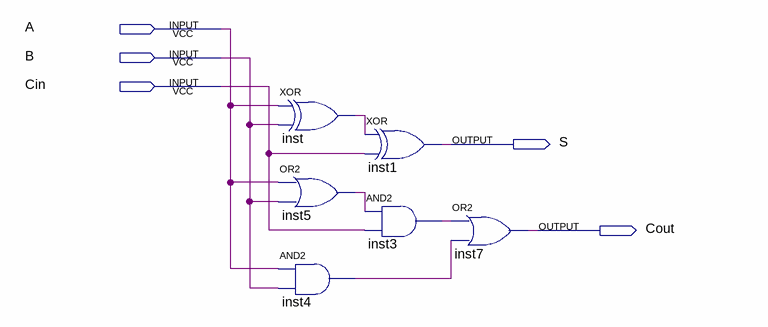
[diagram p0: schematic sheet]
// Quartus schematic project-6.bdf as structural Verilog: 6 symbols, 5 pins
module \project-6  (
  input  A,
  input  B,
  input  Cin,
  output S,
  output Cout
);

  wire inst3_out, inst4_out, inst5_out, inst_out;

  xor inst (inst_out, A, B);
  or inst5 (inst5_out, A, B);
  and inst4 (inst4_out, A, B);
  xor inst1 (S, inst_out, Cin);
  and inst3 (inst3_out, inst5_out, Cin);
  or inst7 (Cout, inst3_out, inst4_out);
endmodule
